# Altium schematic sheet Altium_2_v03_01_GLUE_LOGIC_4Plane_P2.schdoc
size 309 x 223 mm; Symbol: Sheet-Symbol_A4; Device: Sheet-Symbol_A4; @Project Name: The20c_v03; @Page Count: 3; @Update Date: 2026-09-12; @Create Date: 2026-09-12; @Schematic Name: v03_01_GLUE_LOGIC_4Plane; @Page No: 2; @Page Name: v03_01_GLUE_LOGIC_4Plane_P2; Company: OsoLabs.tech; Reviewed: OsoLabs; Version: v03_01; Page Size: A4; Part Number: v03_01_GLUE_LOGIC; Drawn: OsoLabs; @Board Name: v03_01_GLUE_LOGIC_4Plane; @Create Time: 14:46:09; @Update Time: 11:47:50
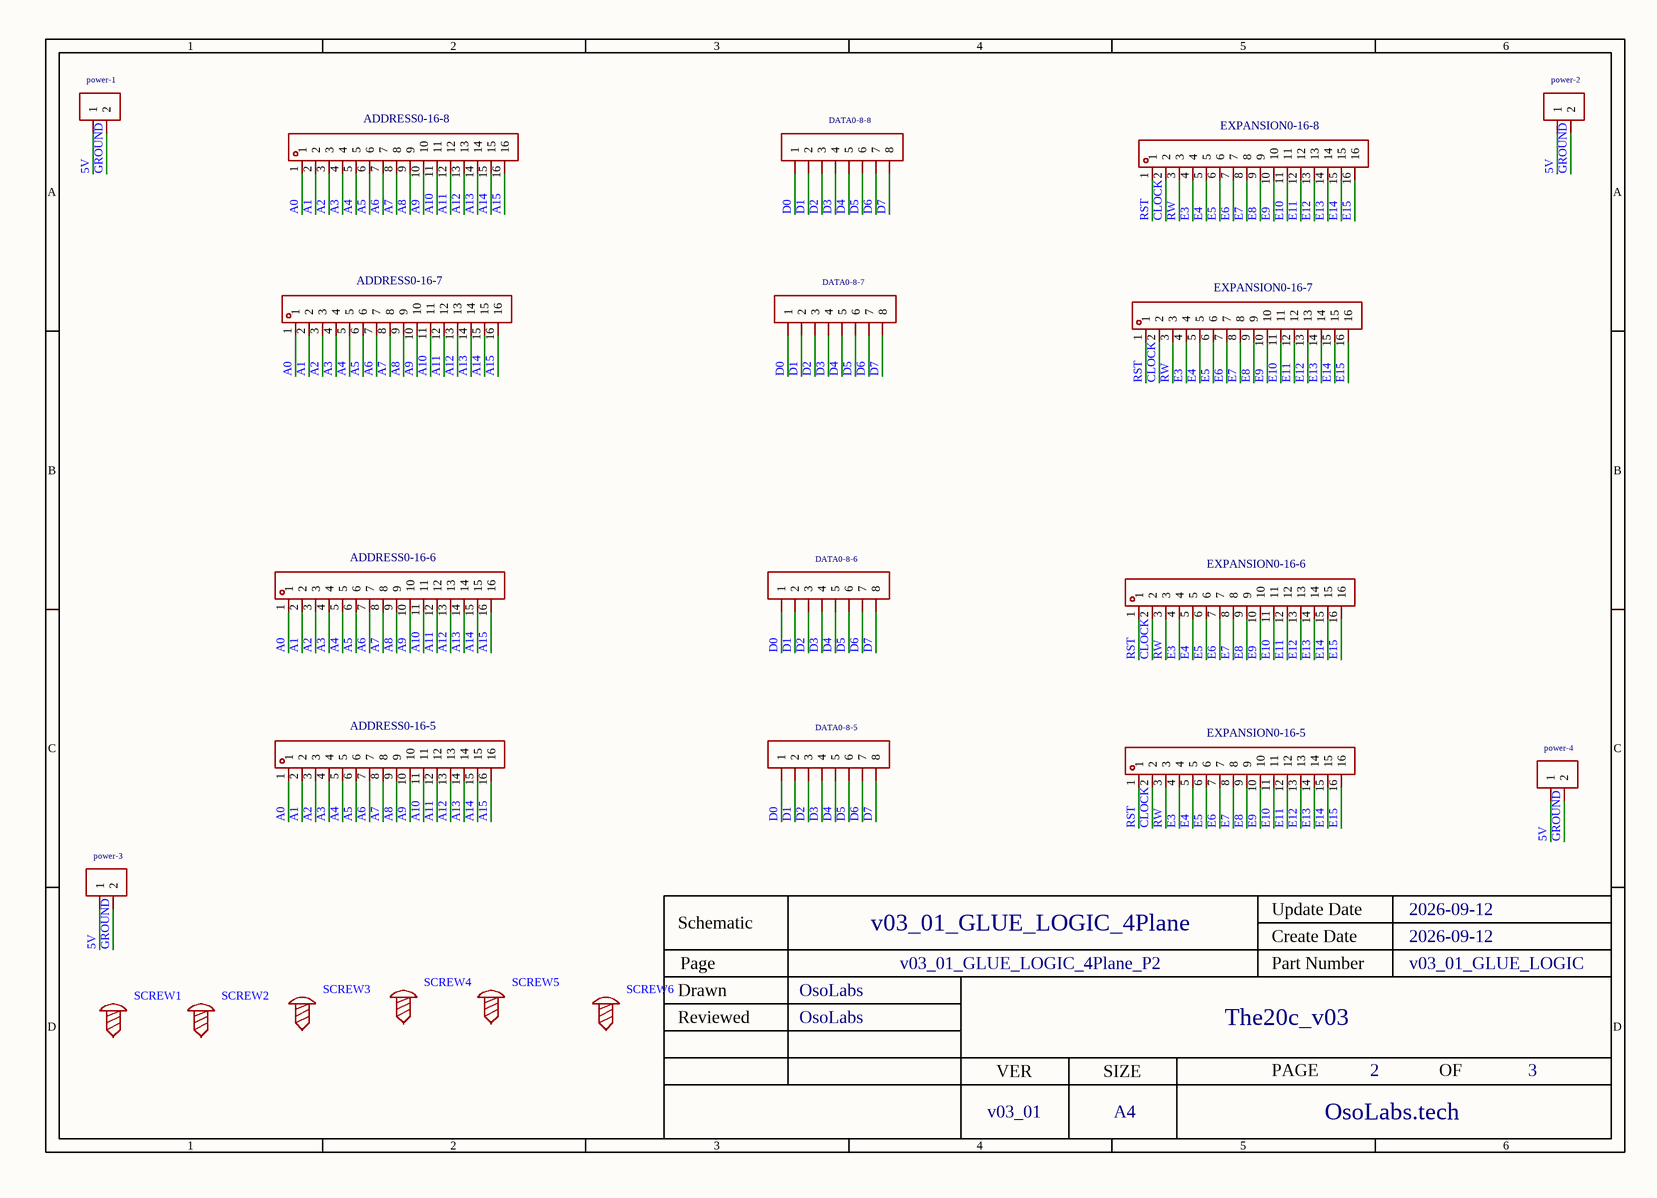
[diagram p0: Altium_2_v03_01_GLUE_LOGIC_4Plane_P2.schdoc]

## Parts
ADDRESS0-16-5  PM254-1-16-Z-8.5  [HDR-TH_16P-P2.54-V-F-A]  (value not drawn)
ADDRESS0-16-6  PM254-1-16-Z-8.5  [HDR-TH_16P-P2.54-V-F-A]  (value not drawn)
ADDRESS0-16-7  PM254-1-16-Z-8.5  [HDR-TH_16P-P2.54-V-F-A]  (value not drawn)
ADDRESS0-16-8  PM254-1-16-Z-8.5  [HDR-TH_16P-P2.54-V-F-A]  (value not drawn)
DATA0-8-5  2.54-1*8P母环保  [HDR-TH_8P-P2.54-V-F-1]  (value not drawn)
DATA0-8-6  2.54-1*8P母环保  [HDR-TH_8P-P2.54-V-F-1]  (value not drawn)
DATA0-8-7  2.54-1*8P母环保  [HDR-TH_8P-P2.54-V-F-1]  (value not drawn)
DATA0-8-8  2.54-1*8P母环保  [HDR-TH_8P-P2.54-V-F-1]  (value not drawn)
EXPANSION0-16-5  PM254-1-16-Z-8.5  [HDR-TH_16P-P2.54-V-F-A]  (value not drawn)
EXPANSION0-16-6  PM254-1-16-Z-8.5  [HDR-TH_16P-P2.54-V-F-A]  (value not drawn)
EXPANSION0-16-7  PM254-1-16-Z-8.5  [HDR-TH_16P-P2.54-V-F-A]  (value not drawn)
EXPANSION0-16-8  PM254-1-16-Z-8.5  [HDR-TH_16P-P2.54-V-F-A]  (value not drawn)
power-1  2.54-1*2P母  [HDR-TH_2P-P2.54-V-F]  (value not drawn)
power-2  2.54-1*2P母  [HDR-TH_2P-P2.54-V-F]  (value not drawn)
power-3  2.54-1*2P母  [HDR-TH_2P-P2.54-V-F]  (value not drawn)
power-4  2.54-1*2P母  [HDR-TH_2P-P2.54-V-F]  (value not drawn)
SCREW1  (no value)  [Screw-Hole-M3]
SCREW2  (no value)  [Screw-Hole-M3]
SCREW3  (no value)  [Screw-Hole-M3]
SCREW4  (no value)  [Screw-Hole-M3]
SCREW5  (no value)  [Screw-Hole-M3]
SCREW6  (no value)  [Screw-Hole-M3]

## Nets
5V: power-1.1 power-2.1 power-3.1 power-4.1
A0: ADDRESS0-16-5.1 ADDRESS0-16-6.1 ADDRESS0-16-7.1 ADDRESS0-16-8.1
A1: ADDRESS0-16-5.2 ADDRESS0-16-6.2 ADDRESS0-16-7.2 ADDRESS0-16-8.2
A2: ADDRESS0-16-5.3 ADDRESS0-16-6.3 ADDRESS0-16-7.3 ADDRESS0-16-8.3
A3: ADDRESS0-16-5.4 ADDRESS0-16-6.4 ADDRESS0-16-7.4 ADDRESS0-16-8.4
A4: ADDRESS0-16-5.5 ADDRESS0-16-6.5 ADDRESS0-16-7.5 ADDRESS0-16-8.5
A5: ADDRESS0-16-5.6 ADDRESS0-16-6.6 ADDRESS0-16-7.6 ADDRESS0-16-8.6
A6: ADDRESS0-16-5.7 ADDRESS0-16-6.7 ADDRESS0-16-7.7 ADDRESS0-16-8.7
A7: ADDRESS0-16-5.8 ADDRESS0-16-6.8 ADDRESS0-16-7.8 ADDRESS0-16-8.8
A8: ADDRESS0-16-5.9 ADDRESS0-16-6.9 ADDRESS0-16-7.9 ADDRESS0-16-8.9
A9: ADDRESS0-16-5.10 ADDRESS0-16-6.10 ADDRESS0-16-7.10 ADDRESS0-16-8.10
A10: ADDRESS0-16-5.11 ADDRESS0-16-6.11 ADDRESS0-16-7.11 ADDRESS0-16-8.11
A11: ADDRESS0-16-5.12 ADDRESS0-16-6.12 ADDRESS0-16-7.12 ADDRESS0-16-8.12
A12: ADDRESS0-16-5.13 ADDRESS0-16-6.13 ADDRESS0-16-7.13 ADDRESS0-16-8.13
A13: ADDRESS0-16-5.14 ADDRESS0-16-6.14 ADDRESS0-16-7.14 ADDRESS0-16-8.14
A14: ADDRESS0-16-5.15 ADDRESS0-16-6.15 ADDRESS0-16-7.15 ADDRESS0-16-8.15
A15: ADDRESS0-16-5.16 ADDRESS0-16-6.16 ADDRESS0-16-7.16 ADDRESS0-16-8.16
CLOCK: EXPANSION0-16-5.2 EXPANSION0-16-6.2 EXPANSION0-16-7.2 EXPANSION0-16-8.2
D0: DATA0-8-5.1 DATA0-8-6.1 DATA0-8-7.1 DATA0-8-8.1
D1: DATA0-8-5.2 DATA0-8-6.2 DATA0-8-7.2 DATA0-8-8.2
D2: DATA0-8-5.3 DATA0-8-6.3 DATA0-8-7.3 DATA0-8-8.3
D3: DATA0-8-5.4 DATA0-8-6.4 DATA0-8-7.4 DATA0-8-8.4
D4: DATA0-8-5.5 DATA0-8-6.5 DATA0-8-7.5 DATA0-8-8.5
D5: DATA0-8-5.6 DATA0-8-6.6 DATA0-8-7.6 DATA0-8-8.6
D6: DATA0-8-5.7 DATA0-8-6.7 DATA0-8-7.7 DATA0-8-8.7
D7: DATA0-8-5.8 DATA0-8-6.8 DATA0-8-7.8 DATA0-8-8.8
E3: EXPANSION0-16-5.4 EXPANSION0-16-6.4 EXPANSION0-16-7.4 EXPANSION0-16-8.4
E4: EXPANSION0-16-5.5 EXPANSION0-16-6.5 EXPANSION0-16-7.5 EXPANSION0-16-8.5
E5: EXPANSION0-16-5.6 EXPANSION0-16-6.6 EXPANSION0-16-7.6 EXPANSION0-16-8.6
E6: EXPANSION0-16-5.7 EXPANSION0-16-6.7 EXPANSION0-16-7.7 EXPANSION0-16-8.7
E7: EXPANSION0-16-5.8 EXPANSION0-16-6.8 EXPANSION0-16-7.8 EXPANSION0-16-8.8
E8: EXPANSION0-16-5.9 EXPANSION0-16-6.9 EXPANSION0-16-7.9 EXPANSION0-16-8.9
E9: EXPANSION0-16-5.10 EXPANSION0-16-6.10 EXPANSION0-16-7.10 EXPANSION0-16-8.10
E10: EXPANSION0-16-5.11 EXPANSION0-16-6.11 EXPANSION0-16-7.11 EXPANSION0-16-8.11
E11: EXPANSION0-16-5.12 EXPANSION0-16-6.12 EXPANSION0-16-7.12 EXPANSION0-16-8.12
E12: EXPANSION0-16-5.13 EXPANSION0-16-6.13 EXPANSION0-16-7.13 EXPANSION0-16-8.13
E13: EXPANSION0-16-5.14 EXPANSION0-16-6.14 EXPANSION0-16-7.14 EXPANSION0-16-8.14
E14: EXPANSION0-16-5.15 EXPANSION0-16-6.15 EXPANSION0-16-7.15 EXPANSION0-16-8.15
E15: EXPANSION0-16-5.16 EXPANSION0-16-6.16 EXPANSION0-16-7.16 EXPANSION0-16-8.16
GROUND: power-1.2 power-2.2 power-3.2 power-4.2
RST: EXPANSION0-16-5.1 EXPANSION0-16-6.1 EXPANSION0-16-7.1 EXPANSION0-16-8.1
RW: EXPANSION0-16-5.3 EXPANSION0-16-6.3 EXPANSION0-16-7.3 EXPANSION0-16-8.3

Not connected (* = marked no-connect by the designer): SCREW1 1; SCREW2 1; SCREW3 1; SCREW4 1; SCREW5 1; SCREW6 1

## Notes on the sheet
- 1
- 2
- 3
- 4
- 5
- 6
- A
- B
- C
- Schematic
- v03_01_GLUE_LOGIC_4Plane
- Create Date
- Update Date
- 2026-09-12
- Reviewed
- Drawn
- Page
- OsoLabs
- v03_01_GLUE_LOGIC_4Plane_P2
- Part Number
- The20c_v03
- v03_01_GLUE_LOGIC
- D
- VER
- SIZE
- PAGE
- OF
- v03_01
- A4
- OsoLabs.tech

## Library data of the parts
ADDRESS0-16-5-ADDRESS0-16-8 EXPANSION0-16-5-EXPANSION0-16-8 = PM254-1-16-Z-8.5: Manufacturer: HCTL(华灿天禄); Add into BOM: yes; Holes Structure: 1x16P; Pitch: 2.54mm; Circular Hole / Square Hole: Square Holes; Number of Holes: 16P; Current Rating (Max): 3A; Holes Direction: Top; Soldering Temperature(Max): 260℃@5S; Symbol: PM254-1-16-Z-8.5; Device: PM254-1-16-Z-8.5; LCSC Part Name: 1x16P 间距:2.54mm 直插; Supplier Part: C2897379; Manufacturer Part: PM254-1-16-Z-8.5; Supplier Footprint: 插件,P=2.54mm; JLCPCB Part Class: Extended Part; Datasheet: https://atta.szlcsc.com/upload/public/pdf/source/20230609/534BE42964C679BDE98E061007C4ABD6.pdf; Supplier: LCSC; Convert to PCB: yes; Row Spacing: -; Mounting Type: Straight; Number of Rows: Plugin; Voltage Rating (Max): -; Insulation Height: 8.5mm; Contact Material: Copper Alloy; Operating Temperature Range: -40℃~+105℃
DATA0-8-5-DATA0-8-8 = 2.54-1*8P母环保: Manufacturer: BOOMELE(博穆精密); Symbol: Header-Female-2.54_1x8; Add into BOM: yes; Holes Structure: 1x8P; Pitch: 2.54mm; Number of Holes: 8P; Device: 2.54-1*8P母环保; Supplier: LCSC; Manufacturer Part: 2.54-1*8P母环保; Supplier Part: C27438; JLCPCB Part Class: Extended Part; LCSC Part Name: 间距:2.54mm 1x8P 直插; Supplier Footprint: 插件,P=2.54mm; Datasheet: https://atta.szlcsc.com/upload/public/pdf/source/20231221/1CA800C6799ED97958773716FAA1BFFE.pdf; Convert to PCB: yes; Row Spacing: -; Mounting Type: Straight; Number of Rows: Plugin; Insulation Height: -; Contact Material: -; Contact Plating: -
power-1-power-4 = 2.54-1*2P母: Manufacturer: BOOMELE(博穆精密); Symbol: Header-Female-2.54_1x2; Add into BOM: yes; Holes Structure: 1x2P; Pitch: 2.54mm; Number of Holes: 2P; Device: 2.54-1*2P母; Supplier: LCSC; Manufacturer Part: 2.54-1*2P母; Supplier Part: C49661; JLCPCB Part Class: Extended Part; LCSC Part Name: 间距:2.54mm 1x2P 直插; Supplier Footprint: 插件,P=2.54mm; Datasheet: https://atta.szlcsc.com/upload/public/pdf/source/20210301/C2718488_F4427B881E42CAA8DDB0B1C12B3A522C.pdf; Convert to PCB: yes; Row Spacing: -; Mounting Type: Straight; Number of Rows: Plugin; Insulation Height: -; Contact Material: -; Contact Plating: -
SCREW1-SCREW6 = Screw-Hole-M3: Convert to PCB: yes; Symbol: Screw-Hole; Device: Screw-Hole-M3; Add into BOM: yes; Supplier Footprint: 插件